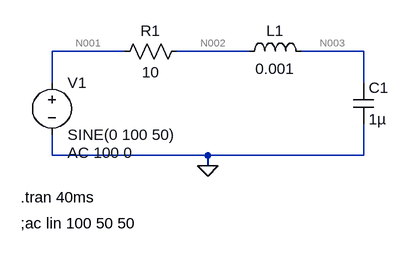
[diagram p0: schematic Draft5.asc]
Draft5.asc, the LTspice schematic file:
Version 4
SHEET 1 880 680
WIRE 64 80 -48 80
WIRE 256 80 144 80
WIRE 432 80 336 80
WIRE -48 128 -48 80
WIRE 432 128 432 80
WIRE -48 240 -48 208
WIRE 192 240 -48 240
WIRE 432 240 432 192
WIRE 432 240 192 240
WIRE 192 256 192 240
FLAG 192 256 0
SYMBOL voltage -48 112 R0
WINDOW 123 24 124 Left 2
WINDOW 39 0 0 Left 0
SYMATTR InstName V1
SYMATTR Value SINE(0 100 50)
SYMATTR Value2 AC 100 0
SYMBOL res 160 64 R90
WINDOW 0 0 56 VBottom 2
WINDOW 3 32 56 VTop 2
SYMATTR InstName R1
SYMATTR Value 10
SYMBOL ind 240 96 R270
WINDOW 0 32 56 VTop 2
WINDOW 3 5 56 VBottom 2
SYMATTR InstName L1
SYMATTR Value 0.001
SYMBOL cap 416 128 R0
SYMATTR InstName C1
SYMATTR Value 1µ
TEXT -96 344 Left 2 !;ac lin 100 50 50
TEXT -96 304 Left 2 !.tran 40ms

The netlist it stands for:
* Draft5.asc
V1 N001 0 SINE(0 100 50) AC 100 0
R1 N002 N001 10
L1 N002 N003 0.001
C1 N003 0 1µ
;ac lin 100 50 50
.tran 40ms
.backanno
.end

* Results of the author's LTspice run, read from the files saved beside the schematic
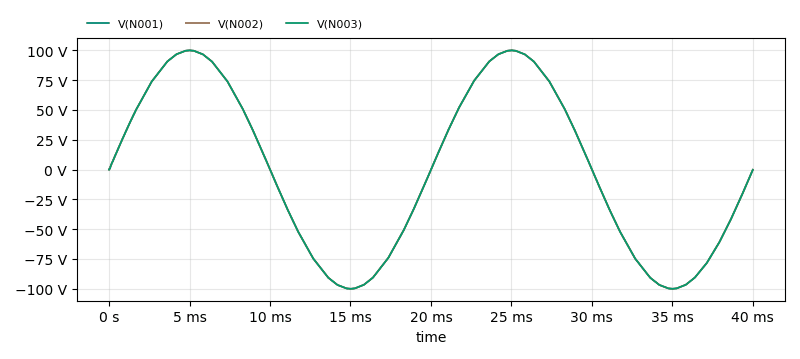
[diagram p1: Transient Analysis of Draft5.asc, plotted from the saved traces]
* Transient Analysis, 1 run:
*   V(N001): min -100 V, max 100 V, average -9.328 mV, rms 70.68 V, last 0 V
*   V(N002): min -100 V, max 100 V, average -9.272 mV, rms 70.68 V, last -314.2 mV
*   V(N003): min -100 V, max 100 V, average -10.07 mV, rms 70.69 V, last -314.3 mV